# EasyEDA schematic 1-Schematic_ceiling-light.json
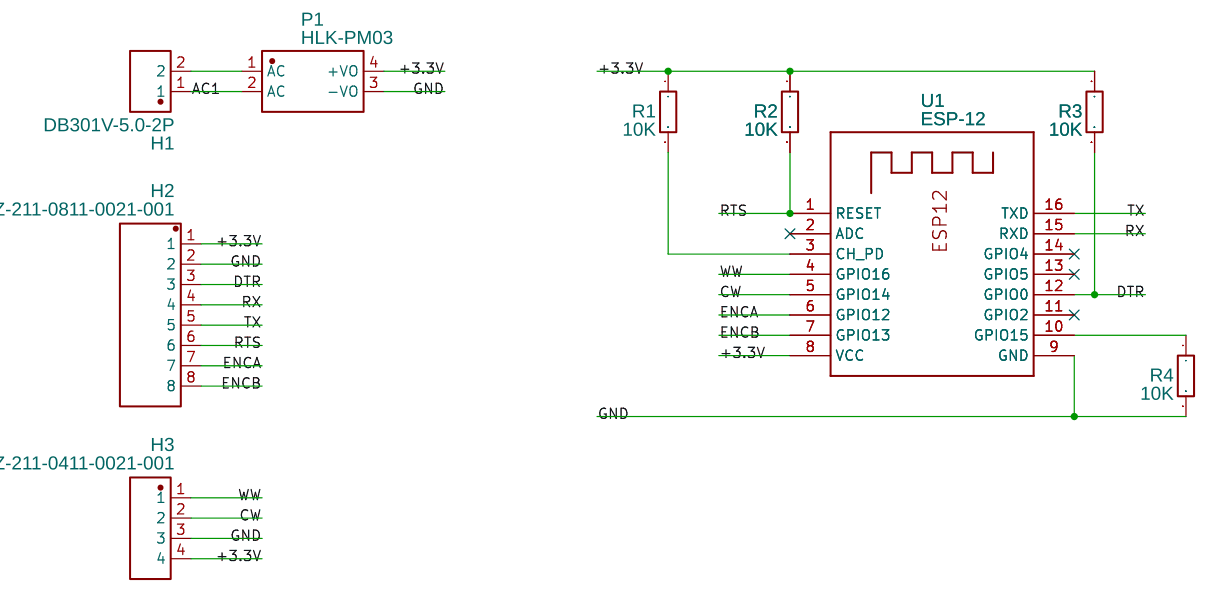
[diagram p0: schematic sheet]

## Parts
H1  DB301V-5.0-2P  [CONN-TH_2PIN-V-PITCH5.00-L_JL126-50002G01]
H2  Z-211-0811-0021-001  [HDR-TH_8P-P2.54-V]
H3  Z-211-0411-0021-001  [HDR-4X1/2.54]
P1  HLK-PM03  [PWRM-TH_HLK-PM01]
R1  10K  [0603]
R2  10K  [0603]
R3  10K  [0603]
R4  10K  [0603]
U1  ESP-12  [ESP-12]

## Library data of the parts
H1 = -: Supplier: LCSC; Supplier Part: C395882; Manufacturer: DIBO; Contributor: LCSC
H2 = Z-211-0811-0021-001: Supplier: LCSC; Supplier Part: C190820; Manufacturer: Nextronics Engineering; Contributor: LCSC
H3 = Z-211-0411-0021-001: Supplier: LCSC; Manufacturer: ZHENGLING; Contributor: LCSC; Supplier Part: C152150
P1 = -: Supplier: LCSC; Supplier Part: C209904; Manufacturer: HI-LINK; Contributor: LCSC
R1-R4 = RMC16K103FTP: Supplier: LCSC; Supplier Part: C323556; Manufacturer: KAMAYA; Contributor: LCSC
U1 = ESP-12: Contributor: Adafruit

## Nets
+3.3V: H2.1 H3.4 P1.4(+VO) R1.1 R2.1 R3.1 U1.8(VCC)
GND: H2.2 H3.3 P1.3(-VO) R4.2 U1.9(GND)
AC1: H1.1 P1.2(AC)
CW: H3.2 U1.5(GPIO14)
DTR: H2.3 R3.2 U1.12(GPIO0)
ENCA: H2.7 U1.6(GPIO12)
ENCB: H2.8 U1.7(GPIO13)
RTS: H2.6 R2.2 U1.1(RESET)
RX: H2.4 U1.15(RXD)
TX: H2.5 U1.16(TXD)
WW: H3.1 U1.4(GPIO16)
Net-(H1-2): H1.2 P1.1(AC)
Net-(R1-2): R1.2 U1.3(CH_PD)
Net-(R4-1): R4.1 U1.10(GPIO15)

Not connected (* = marked no-connect by the designer): U1 2(ADC)* 11(GPIO2)* 13(GPIO5)* 14(GPIO4)*
